# Altium schematic sheet laser_diode_driver.SchDoc
size A; SheetNumber: 3; SheetTotal: 3
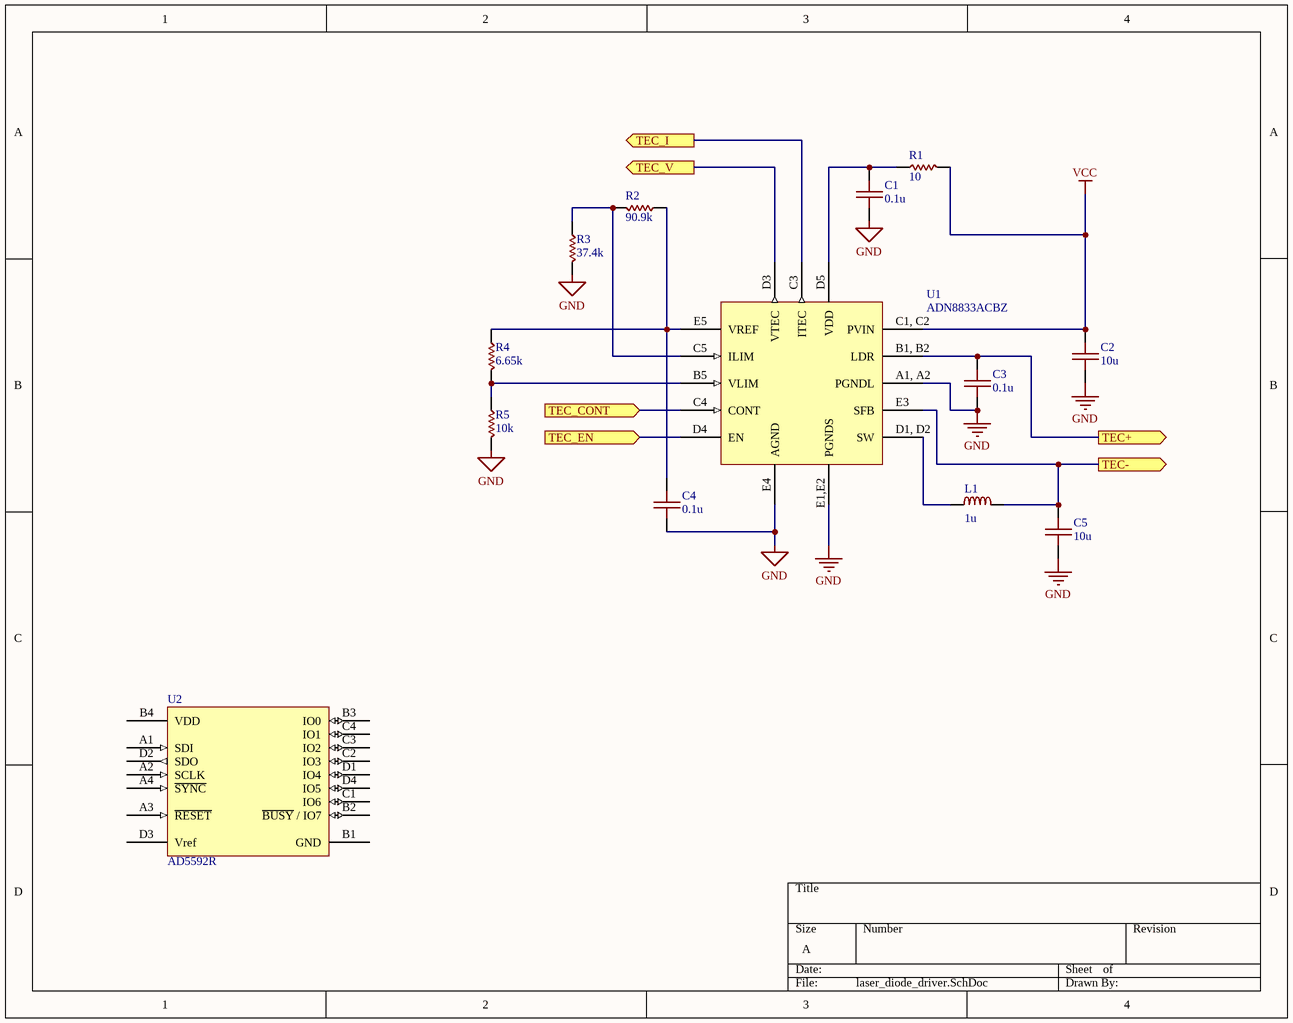
[diagram p0: laser_diode_driver.SchDoc]

## Parts
C1  0.1u  [0402 B]
C2  10u  [0603 B]
C3  0.1u  [0402 B]
C4  0.1u  [0402 B]
C5  10u  [0402 B]
L1  1u  [0806]
R1  10  [0402]
R2  90.9k  [0402]
R3  37.4k  [0402]
R4  6.65k  [0402]
R5  10k  [0402]
U1  ADN8833ACBZ  [BGA 25 7]
U2  AD5592R  [BGA 16 3]

## Ports
TEC+ (out), TEC- (out), TEC_CONT (in), TEC_EN (in), TEC_I (out), TEC_V (out)

## Nets
GND: C1.1 C2.1 C3.1 C4.1 C5.1 R3.1 R5.1 U1.A1,_A2(PGNDL) U1.E1,E2(PGNDS) U1.E4(AGND)
VCC: C2.2 R1.1 U1.C1,_C2(PVIN)
TEC+: C3.2 U1.B1,_B2(LDR) ; port TEC+
TEC-: C5.2 L1.1 U1.E3(SFB) ; port TEC-
TEC_CONT: U1.C4(CONT) ; port TEC_CONT
TEC_EN: U1.D4(EN) ; port TEC_EN
TEC_I: U1.C3(ITEC) ; port TEC_I
TEC_V: U1.D3(VTEC) ; port TEC_V
NetC1_2: C1.2 R1.2 U1.D5(VDD)
NetC4_2: C4.2 R2.2 R4.2 U1.E5(VREF)
NetL1_2: L1.2 U1.D1,_D2(SW)
NetR2_1: R2.1 R3.2 U1.C5(ILIM)
NetR4_1: R4.1 R5.2 U1.B5(VLIM)

Not connected (* = marked no-connect by the designer): U2 A1(SDI) A2(SCLK) A3(~{RESET}) A4(~{SYNC}) B1(GND) B2(~{BUSY}_/_IO7) B3(IO0) B4(VDD) C1(IO6) C2(IO3) C3(IO2) C4(IO1) D1(IO4) D2(SDO) D3(Vref) D4(IO5)

## Library data of the parts
C1 C3-C5 = CAP 0402: 402 Capacitor
  C1 C3 C4: Value: 0.1u
  C5: Value: 10u
C2 = CAP 0603: 603 Capacitor; Value: 10u
L1 = IND 0806: Generic 806 Inductor; Value: 1u
R1-R5 = RES 0402: 402 Resistor
  R1: Value: 10
  R2: Value: 90.9k
  R3: Value: 37.4k
  R4: Value: 6.65k
  R5: Value: 10k
U1 = ADN8833: Ultra  compact, 1 A Thermoelectric Cooler Driver for Digital Control Systems; Ref: ADN8833ACBZ
U2 = AD5592R: 8-Channel, 12-Bit, Configurable ADC/DAC with On-Chip Reference, SPI Interface; Ref: AD5592R